# EAGLE schematic OeShield (EAGLE 7.2.0)
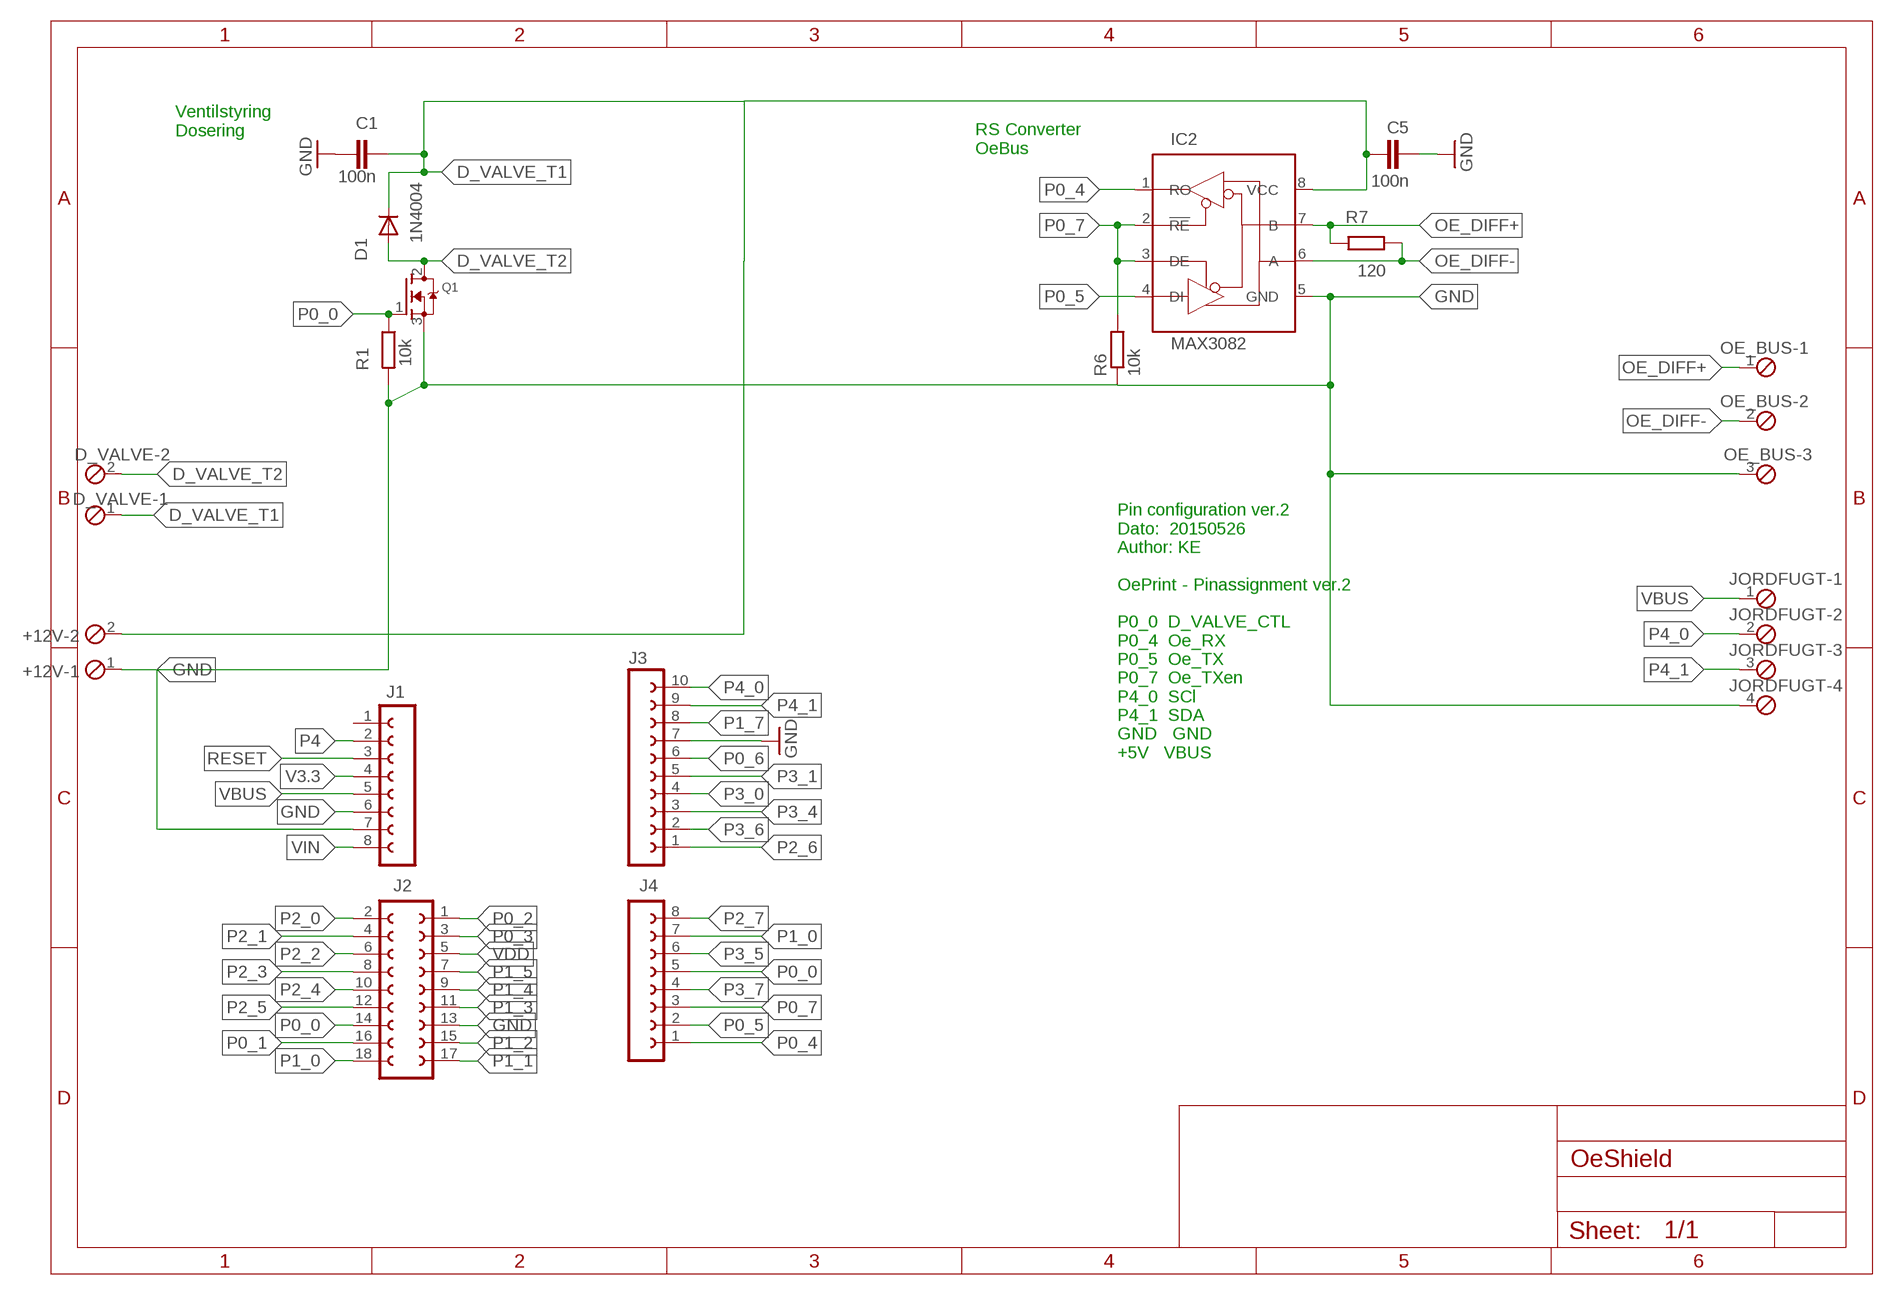
[diagram p0: schematic, sheet 1]

## Parts
+12V  MPT2  [2POL254]
C1  100n  C5/3  [C5B3]
C5  100n  C5/3  [C5B3]
D1  1N4004  [DO41-10]
D_VALVE  MPT2  [2POL254]
IC2  MAX3082  MAX3082CPD  [DIL08]
J1  FE08-1  [FE08]
J2  FE09-2  [FE09-2]
J3  FE10-1  [FE10]
J4  FE08-1  [FE08]
JORDFUGT  MPT4  [4POL254]
OE_BUS  MPT3  [3POL254]
Q1  MOSFET-NGDS_TO220V  [TO220V]
R1  10k  R-EU_0207/12  [0207/12]
R6  10k  R-EU_0207/12  [0207/12]
R7  120  R-EU_0207/12  [0207/12]

## Nets
D_VALVE_T1: +12V.2 C1.1 C5.1 D1.C D_VALVE.1 IC2.8(VCC)
D_VALVE_T2: D1.A D_VALVE.2 Q1.2(D)
GND: +12V.1 C1.2 C5.2 IC2.5(GND) J1.6 J1.7 J2.13 J3.7 JORDFUGT.4 OE_BUS.3 Q1.3(S) R1.2 R6.1
OE_DIFF+: IC2.7(B) OE_BUS.1 R7.2
OE_DIFF-: IC2.6(A) OE_BUS.2 R7.1
P0_0: J2.14 J4.5 Q1.1(G) R1.1
P0_1: J2.16
P0_2: J2.1
P0_3: J2.3
P0_4: IC2.1(RO) J4.1
P0_5: IC2.4(DI) J4.2
P0_6: J3.6
P0_7: IC2.2(!RE!) IC2.3(DE) J4.3 R6.2
P1_0: J2.18 J4.7
P1_1: J2.17
P1_2: J2.15
P1_3: J2.11
P1_4: J2.9
P1_5: J2.7
P1_7: J3.8
P2_0: J2.2
P2_1: J2.4
P2_2: J2.6
P2_3: J2.8
P2_4: J2.10
P2_5: J2.12
P2_6: J3.1
P2_7: J4.8
P3_0: J3.4
P3_1: J3.5
P3_4: J3.3
P3_5: J4.6
P3_6: J3.2
P3_7: J4.4
P4: J1.2
P4_0: J3.10 JORDFUGT.2
P4_1: J3.9 JORDFUGT.3
RESET: J1.3
V3.3: J1.4
VBUS: J1.5 JORDFUGT.1
VDD: J2.5
VIN: J1.8
Unconnected: J1.1

## Notes on the sheet
- Ventilstyring 
  Dosering
- RS Converter
  OeBus
- Pin configuration ver.2
  Dato:  20150526
  Author: KE
  
  OePrint - Pinassignment ver.2
  
  P0_0  D_VALVE_CTL
  P0_4  Oe_RX
  P0_5  Oe_TX
  P0_7  Oe_TXen
  P4_0  SCl
  P4_1  SDA
  GND   GND
  +5V   VBUS

## Library data of the parts
+12V D_VALVE = con-phoenix-254:MPT2: PHOENIX CONNECTOR; OC_FARNELL: unknown; OC_NEWARK: unknown
C1 C5 = capacitor-wima:C: CAPACITOR naming: grid - package width
D1 = adafruit:1N4004: DIODE General purpose 1N400x type rectifier (With bigger pads) http://www.ladyada.net/library/pcb/eaglelibrary.html
IC2 = myLibrary:MAX3082: RS485 transceiver Converting from logical RS232 to differential RS485, and vice versa.; OC_FARNELL: unknown; OC_NEWARK: unknown
J1 J4 = con-lsta:FE08-1: FEMALE HEADER; OC_FARNELL: unknown; OC_NEWARK: unknown
J2 = con-lsta:FE09-2: FEMALE HEADER; OC_FARNELL: unknown; OC_NEWARK: unknown
J3 = con-lsta:FE10-1: FEMALE HEADER; OC_FARNELL: unknown; OC_NEWARK: unknown
JORDFUGT = con-phoenix-254:MPT4: PHOENIX CONNECTOR; OC_FARNELL: unknown; OC_NEWARK: unknown
OE_BUS = con-phoenix-254:MPT3: PHOENIX CONNECTOR; OC_FARNELL: unknown; OC_NEWARK: unknown
Q1 = adafruit:MOSFET-N: N-Channel Mosfet 2N7002E - 60V 260mA SOT23 [Digikey: 2N7002ET1GOSTR-ND] - REEL BSH103 - 30V 850mA SOT23 [Digikey: 568-5013-1-ND]
R1 R6 R7 = resistor:R-EU_: RESISTOR, European symbol